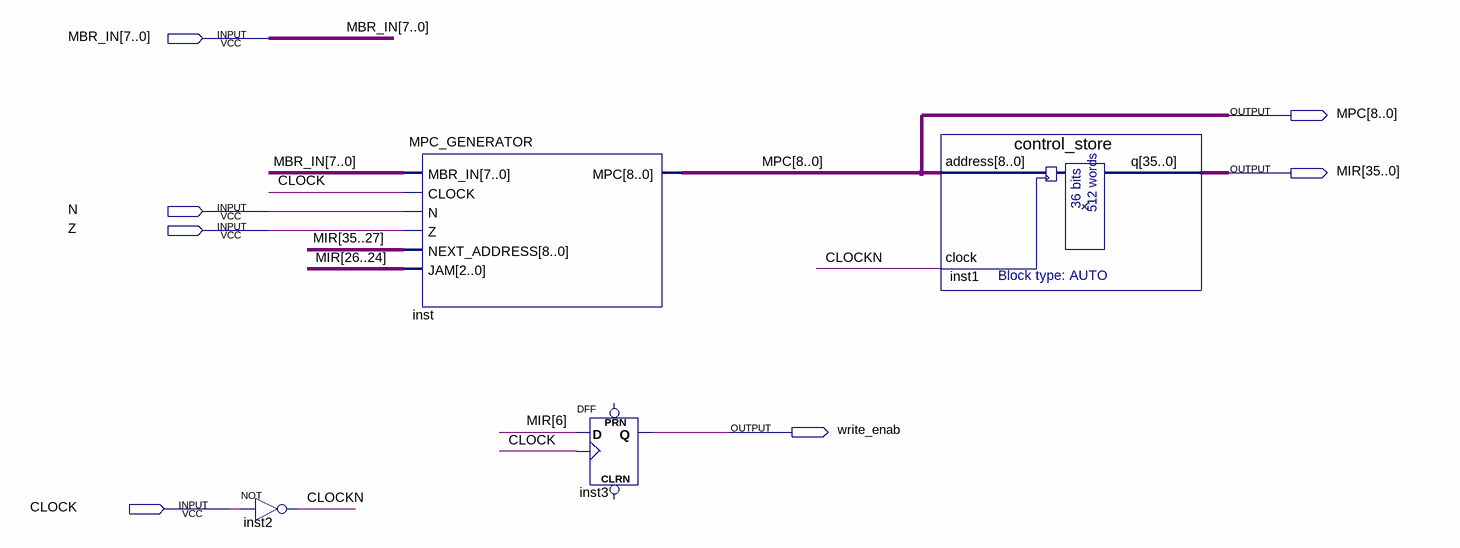
[diagram p0: schematic sheet]
// Quartus schematic CONTROL_UNIT.bdf as structural Verilog: 4 symbols, 7 pins
module CONTROL_UNIT (
  input  [7:0] MBR_IN,
  input  N,
  input  Z,
  input  CLOCK,
  output [8:0] MPC,
  output [35:0] MIR,
  output write_enab
);

  wire CLOCKN;

  not inst2 (CLOCKN, CLOCK);
  MPC_GENERATOR inst (
    .MBR_IN(MBR_IN), .CLOCK(CLOCK), .N(N), .Z(Z), .NEXT_ADDRESS(MIR[35:27]), .JAM(MIR[26:24]), .MPC(MPC));
  DFF inst3 (.CLK(CLOCK), .D(MIR[6]), .Q(write_enab));  // open: CLRN, PRN
  control_store inst1 (.address(MPC), .clock(CLOCKN), .q(MIR));
endmodule
